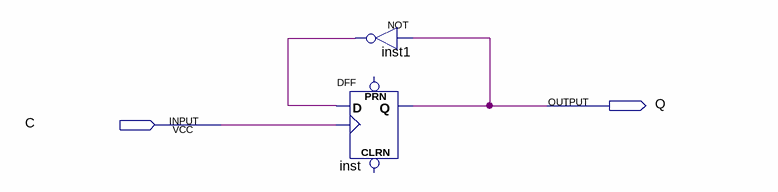
[diagram p0: schematic sheet]
// Quartus schematic Lab_7.bdf as structural Verilog: 2 symbols, 2 pins
module Lab_7 (
  input  C,
  output Q
);

  wire inst1_out;

  not inst1 (inst1_out, Q);
  DFF inst (.CLK(C), .D(inst1_out), .Q(Q));  // open: CLRN, PRN
endmodule
